# EAGLE design grayhill-knob-board (EAGLE 7.7.0)
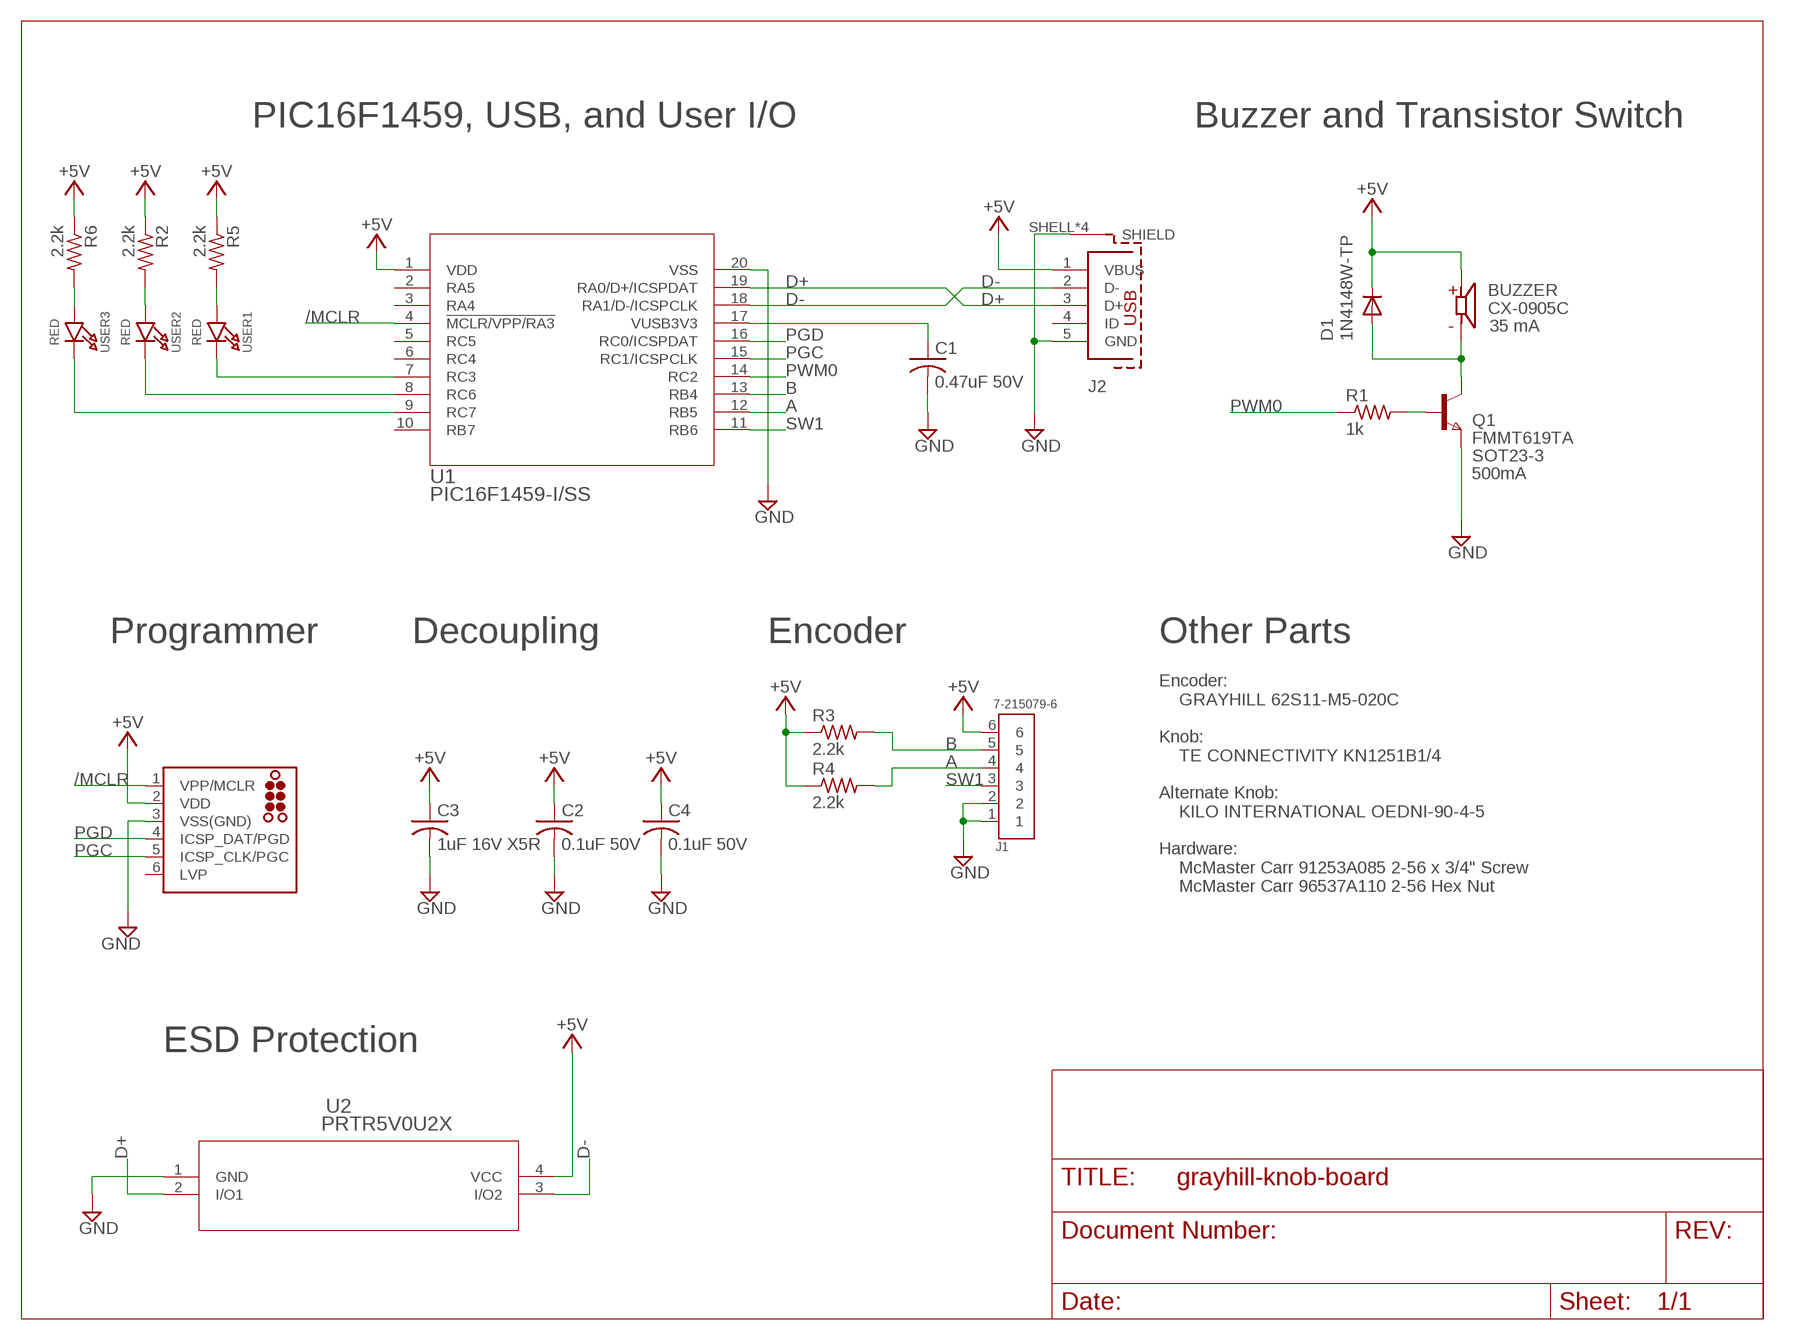
[diagram p0: schematic, sheet 1]

## Parts
BUZZER  CX-0905C  [CUI_CX-0905C]
C1  0.47uF 50V  C-USC1206K  [C1206K]
C2  0.1uF 50V  C-USC1206K  [C1206K]
C3  1uF 16V X5R  C-USC1210  [C1210]
C4  0.1uF 50V  C-USC1206K  [C1206K]
D1  1N4148W-TP  DIODE-SOD123  [SOD123]
J1  7-215079-6  [TE_7-215079-6]
J2  629105136821  [629105136821]
J3  TC2030-MCP-NL  [TC2030-MCP-NL]
Q1  FMMT619TA  NPNSOT23  [SOT-23]
R1  1k  R-US_R0805  [R0805]
R2  2.2k  R-US_R0805  [R0805]
R3  2.2k  R-US_R0805  [R0805]
R4  2.2k  R-US_R0805  [R0805]
R5  2.2k  R-US_R0805  [R0805]
R6  2.2k  R-US_R0805  [R0805]
U1  PIC16F1459-I/SS  [SSOP20_MC]
U2  PRTR5V0U2X  [SOT143B]
USER1  RED  LED0805_NOOUTLINE  [CHIPLED_0805_NOOUTLINE]
USER2  RED  LED0805_NOOUTLINE  [CHIPLED_0805_NOOUTLINE]
USER3  RED  LED0805_NOOUTLINE  [CHIPLED_0805_NOOUTLINE]

## Nets
+5V: BUZZER.P C2.1 C3.1 C4.1 D1.C J1.6 J2.1(VBUS) J3.2(VDD) R2.1 R3.1 R4.1 R5.1 R6.1 U1.1(VDD) U2.4(VCC)
/MCLR: J3.1(VPP/MCLR) U1.4(!MCLR/VPP/RA3)
A: J1.4 R4.2 U1.12(RB5)
B: J1.5 R3.2 U1.13(RB4)
D+: J2.3(D+) U1.19(RA0/D+/ICSPDAT) U2.2(I/O1)
D-: J2.2(D-) U1.18(RA1/D-/ICSPCLK) U2.3(I/O2)
GND: C1.2 C2.2 C3.2 C4.2 J1.1 J1.2 J2.5(GND) J2.SHELL1(SHIELD) J2.SHELL2(SHIELD) J2.SHELL3(SHIELD) J2.SHELL(SHIELD) J3.3(VSS(GND)) Q1.2(E) U1.20(VSS) U2.1(GND)
N$1: R6.2 USER3.A
N$2: R2.2 USER2.A
N$5: R5.2 USER1.A
N$16: Q1.3(B) R1.2
OUT0: BUZZER.N D1.A Q1.1(C)
PGC: J3.5(ICSP_CLK/PGC) U1.15(RC1/ICSPCLK)
PGD: J3.4(ICSP_DAT/PGD) U1.16(RC0/ICSPDAT)
PWM0: R1.1 U1.14(RC2)
SW1: J1.3 U1.11(RB6)
USER1: U1.7(RC3) USER1.C
USER2: U1.8(RC6) USER2.C
USER3: U1.9(RC7) USER3.C
VUSB: C1.1 U1.17(VUSB3V3)
Unconnected: J2.4(ID) J3.6(LVP) U1.2(RA5) U1.3(RA4) U1.5(RC5) U1.6(RC4) U1.10(RB7)

## Notes on the sheet
- PIC16F1459, USB, and User I/O | Buzzer and Transistor Switch
- 35 mA
- SOT23-3
- 500mA
- Programmer | Decoupling | Encoder | Other Parts
- Encoder:
      GRAYHILL 62S11-M5-020C
  
  Knob:
      TE CONNECTIVITY KN1251B1/4
  
  Alternate Knob:
      KILO INTERNATIONAL OEDNI-90-4-5
  
  Hardware:
      McMaster Carr 91253A085 2-56 x 3/4" Screw
      McMaster Carr 96537A110 2-56 Hex Nut
- ESD Protection

## Library data of the parts
BUZZER = CX-0905C:CX-0905C: 9.6 mm, 5 V, 80 dB, 2.7 kHz, Through Hole, Sealed, Driving Circuit, Magnetic Audio Indicator Buzzer; AVAILABILITY: Good; DESCRIPTION: 9.6 mm, 5 V, 80 dB, 2.7 kHz, Through Hole, Sealed, Driving Circuit, Magnetic Audio Indicator Buzzer; MF: CUI; MP: CX-0905C; PACKAGE: CUI; PRICE: 1.32 USD
C1 = rcl:C-US: CAPACITOR, American symbol; MFR: KEMET; MFR_PART_NO: C1206C474K5RACTU
C2 C4 = rcl:C-US: CAPACITOR, American symbol; MFR: KEMET; MFR_PART_NO: C1206S104M5RACTU
C3 = rcl:C-US: CAPACITOR, American symbol; MFR: KEMET; MFR_PART_NO: C1210C105K4PACTU
D1 = diode:DIODE-: DIODE
J1 = 7-215079-6:7-215079-6: Conn FFC Connector F 6 POS 1.27mm Solder ST Thru-Hole Automotive Box; COMMENT: 7-215079-6; DESCRIPTION: Conn FFC Connector F 6 POS 1.27mm Solder ST Thru-Hole Automotive Box/Carton; DIGI-KEY_PART_NUMBER: A30729CT-ND; DIGI-KEY_PURCHASE_URL: https://www.digikey.com/product-detail/en/te-connectivity-amp-connectors/7-215079-6/A30729CT-ND/740377?utm_source=snapeda&utm_medium=aggregator&utm_campaign=symbol; EU_ROHS_COMPLIANCE: Compliant; MF: TE Connectivity; MP: 7-215079-6; PACKAGE: None; TE_PURCHASE_URL: https://www.te.com/usa-en/product-7-215079-6.html?te_bu=Cor&te_type=disp&te_campaign=seda_glo_cor-seda-global-disp-prtnr-fy19-seda-model-bom-cta_sma-317_1&elqCampaignId=32493
J2 = InputOutputIO (rev18a):629105136821: WR-COM SMT Horizontal 5 Contacts Micro USB Type B,5 pins=>Code : Con_I-O_COM_MicroUSB_629105136821 <http://katalog.we-online.de/media/images/eican/Con_I-O_COM_MicroUSB_629105136821_pf2.jpg> Details see: http://katalog.we-online.de/en/em/COM_MICRO_SMT_TYPE_B_HORIZONTAL/629105136821?m Created 2014-07-09, Karrer Zheng 2014 (C) Würth Elektronik
J3 = tag-connect:TC2030: TAG-CONNECT ICSP Connector Manufacturer: Tag-Connect <http://www.tag-connect.com> Cable for easy In-Circuit Serial Programming. Designed for Microchip ICD2, suitable for many others. Two variants - one "with legs" (for hands-free fit on PCB) and another "without legs" for quick programming. PAD Description 1 MCLR/Vpp 2 Vdd 3 GND 4 PGD (ISPDAT) 5 PGC (ISPCLK) 6 nc (used for LVP) ©2009 ROFA.cz - modified and updated by Robert Darlington ‹rdarlington@gmail.com›
Q1 = zetex:NPNSOT23: NPN TRANSISTOR; MPN: DSS20201L-7; OC_FARNELL: 1710688; OC_NEWARK: 25R4555
R1-R6 = rcl:R-US_: RESISTOR, American symbol
U1 = pic16f1459-i-ss:PIC16F1459-I/SS; MANUFACTURER_PART_NUMBER: PIC16F1459ISS; VENDOR: Microchip
U2 = Nexperia_PRTR5V0U2X,215:PRTR5V0U2X; MANUFACTURER_PART_NUMBER: PRTR5V0U2X; VENDOR: NXP
USER1-USER3 = microbuilder:LED: LED 0603 - 0603 Surface Mount Package 2mA: Green LED - Low Power (3.9mcd, 2ma, 1.7Vf) - Digikey: 475-2709-2-ND Orange LED - Low Power (9.8mcd, 2ma, 1.8Vf) - Digikey: 475-1194-2-ND Red LED - Low Power (5mcd, 2ma, 1.8Vf) - Digikey: 475-1195-2-ND Yellow LED - Low Power (7mcd, 2ma, 1.8Vf) - Digikey: 475-1196-2-ND 5mA: Blue LED - Low Power (17mcd, 5ma, 2.9Vf) - Digikey: LNJ937W8CRACT-ND 0805 - 0805 Surface Mount Package 2mA: Red LED (8.8mcd, 2mA, 1.8Vf, Clear) - Low Power [Digikey: 475-2510-1-ND] Green LED (5mcd, 2mA, 1.8Vf, Clear) - Low Power [Digikey: 475-2730-1-ND] Yellow LED (11.3mcd, 2mA, 1.8Vf, Clear) - Low Power [Digikey: 475-2555-1-ND] 20mA: Red LED (104mcd, 20mA, Diffused) - LS R976 [Digikey: 475-1278-6-ND] Red LED (12mcd, 20mA, 2.0Vf, Clear) - APT2012EC [Digikey: 754-1128-1-ND] Green LED (15mcd, 20mA, 2.2Vf, Clear) - APT2012GC [Digikey: 754-1131-1-ND] Orange LED (160mcd, 20mA, 2.1Vf, Clear) - APT2012SECK [Digikey: 754-1130-1-ND] 1206 - 1206 Surface Mount Package Green LED (26mcd, 20mA, Diffused) - LG N971 [Digikey: 475-1407-6-ND] Red LED (15mcd, 20mA, Diffused) - LH N974 [Digikey: 475-1416-6-ND] Cree - Cree High-Power Surface Mount LEDs XPEBWT-L1-0000-00D50 - White 111lm 350mA 2.9Vf 6200K 110° XTEAWT-00-0000-00000LEE3 - White 114lm 350mA 2.85Vf 5000K 115° Everlight - Everlight 45-21 Series Surface Mount LEDs 45-21/QK2C-B2832AC2CB2/2T - Warm White 2000mcd 20mA 3.25Vf 3050K 120° 45-21/LK2C-B38452C4CB2/2T - Nuetral White 2000mcd 20mA 3.25Vf 4150K 120° 45-21/LK2C-B50634C6CB2/2T - Cold White 2200mcd 20mA 3.25Vf 5650K 120° PLCC2 Reverse Mount LS T77K-J1L2-1-0-2-R18-Z - Red 11.25mcd 2mA 1.8Vf 630nm 120° LO T77K-L1M2-24-Z - Orange 19.6mcd 2mA 1.8Vf 606nm 120° LY T77K-K2M1-26-Z - Yellow 15.7mcd 2mA 1.8Vf 587nm 120°

## Board
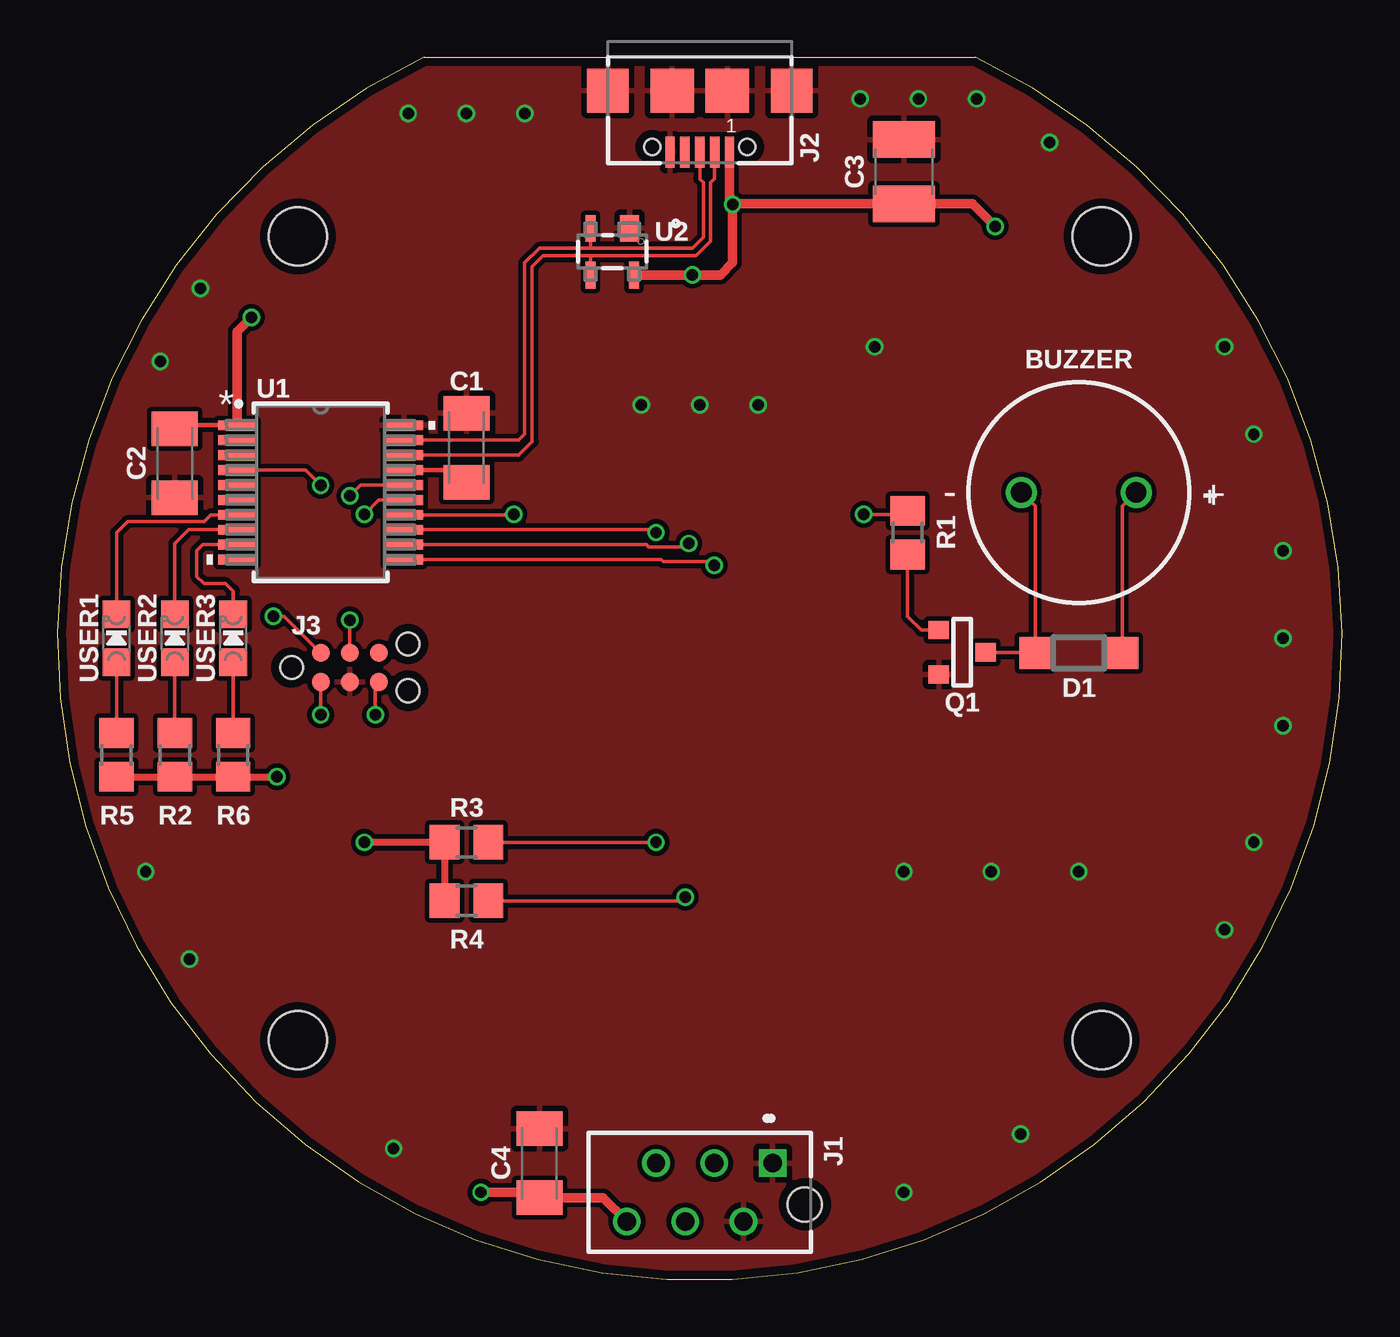
[diagram p1: board, top side]
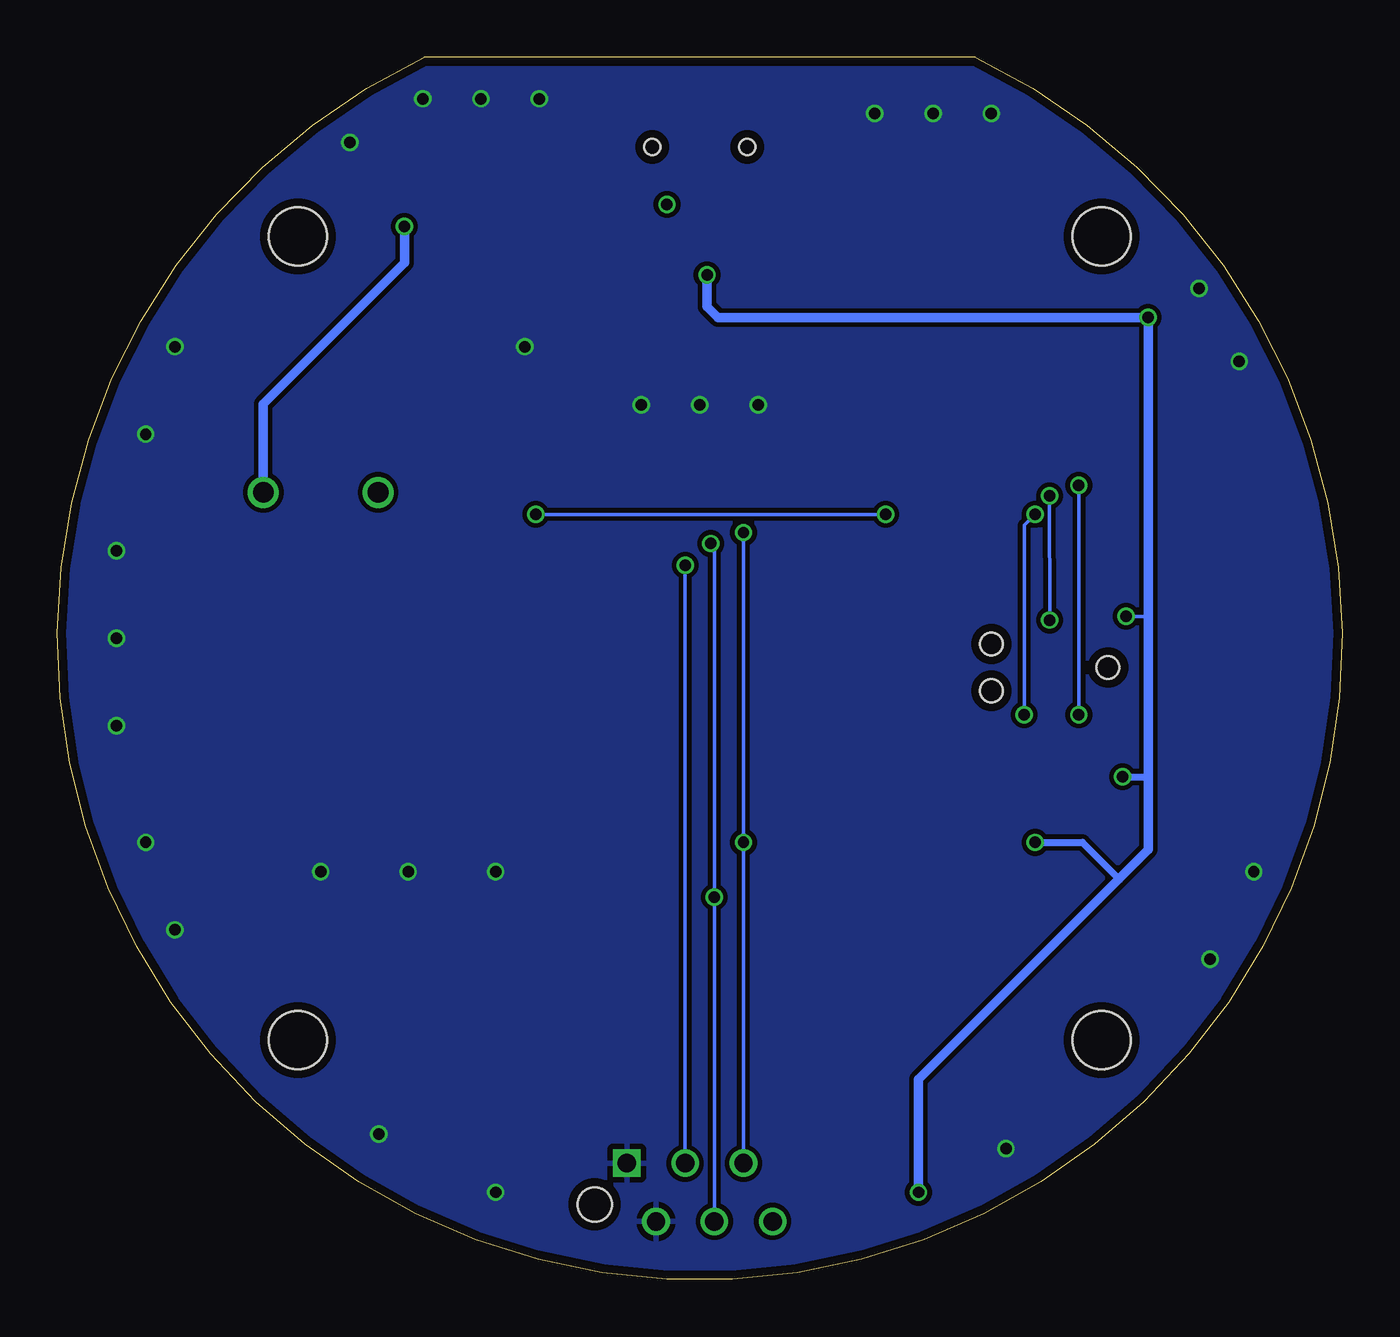
[diagram p2: board, bottom side, seen from below]

Size 55.95 x 53.21 mm. Coordinates in mm from the lower left corner, seen from the top.
Outline: 15.98,53.21 39.98,53.21 arc-309 15.98,53.21
Copper layers (1*16): Top 0.035559375mm / dielectric 1.6mm / Bottom 0.035559375mm
Design rules "oshpark-2layer-2018": minimum track width 6mil, minimum drill 10mil, track to track 6mil, track to pad 6mil, pad to pad 6mil, via to via 6mil, smd to smd 6mil, copper to edge 15mil, drill to drill 6mil, minimum pad ring 5mil, minimum via ring 5mil, stop-mask expansion 2.5mil, vias tented up to drill 0mil, thermal gap 10mil
Holes 2.54 mm at 10.47,10.41 45.48,10.41 10.47,45.41 45.48,45.41
tKeepout: area 42.7,7.6 to 48.2,13.2; area 7.7,42.6 to 13.2,48.2; area 7.7,7.6 to 13.2,13.2; area 42.7,42.6 to 48.2,48.2; area 21.6,7.6 to 34.3,34.3
bKeepout: 20 lines

### Footprints (pad centres in the part's own frame; a part is rotated, then mirrored left to right if it is on the bottom)
CUI_CX-0905C = drill 0.9: N 2.5,0; P -2.5,0
C1206K = smd 1.5 x 2: 1 -1.5,0; 2 1.5,0
C1210 = smd 1.6 x 2.7: 1 -1.4,0; 2 1.4,0
SOD123 = smd 1.4 x 1.4: A 1.9,0; C -1.9,0
TE_7-215079-6 = drill 0.8 square: 1 3.175,1.27 | drill 0.8: 2 1.905,-1.27; 3 0.635,1.27; 4 -0.635,-1.27; 5 -1.905,1.27; 6 -3.175,-1.27 | hole 1.5: 4.575,-0.53
629105136821 = smd 0.4 x 1.35: 1 -1.3,2.675; 2 -0.65,2.675; 3 0,2.675; 4 0.65,2.675; 5 1.3,2.675 | smd 1.8 x 1.9: SHELL -4,0; SHELL3 4,0 | smd 1.9 x 1.9: SHELL1 -1.2,0; SHELL2 1.2,0 | hole 0.7: -2.075,2.45; 2.075,2.45
TC2030-MCP-NL = smd 0.787 x 0.787: 1 1.27,-0.635; 2 1.27,0.635; 3 2.54,-0.635; 4 2.54,0.635; 5 3.81,-0.635; 6 3.81,0.635 | hole 0.991: 0,0; 5.08,-1.016; 5.08,1.016
SOT-23 = smd 0.787 x 0.889: 1 0.025,-1.016; 2 -0.94,1.016; 3 0.991,1.016
R0805 = smd 1.3 x 1.5: 1 -0.95,0; 2 0.95,0
SSOP20_MC = smd 1.651 x 0.432: 1 -3.632,2.925; 2 -3.632,2.275; 3 -3.632,1.625; 4 -3.632,0.975; 5 -3.632,0.325; 6 -3.632,-0.325; 7 -3.632,-0.975; 8 -3.632,-1.625; 9 -3.632,-2.275; 10 -3.632,-2.925; 11 3.632,-2.925; 12 3.632,-2.275; 13 3.632,-1.625; 14 3.632,-0.975; 15 3.632,-0.325; 16 3.632,0.325; 17 3.632,0.975; 18 3.632,1.625; 19 3.632,2.275; 20 3.632,2.925
SOT143B = smd 0.838 x 1.168: 1 -0.747,-1.016 | smd 0.432 x 1.168: 2 0.95,-1.016; 3 0.95,1.016; 4 -0.95,1.016
CHIPLED_0805_NOOUTLINE = smd 1.2 x 1.2: A 0,-1.05; C 0,1.05

### Placement (x,y rotation side)
BUZZER  44.49,34.26 180 top
C1  17.82,36.21 90 top
C2  5.12,35.53 270 top
C3  36.87,48.23 90 top
C4  20.99,5.05 90 top
D1  44.49,27.28 180 top
J1  27.98,3.78 0 top
J2  27.98,51.76 180 top
J3  10.2,26.64 0 top
Q1  39.41,27.28 90 top
R1  37.02,32.52 270 top
R2  5.12,22.83 90 top
R3  17.82,19.02 0 top
R4  17.82,16.48 0 top
R5  2.58,22.83 90 top
R6  7.66,22.83 90 top
U1  11.47,34.26 0 top
U2  24.17,44.75 180 top
USER1  2.58,27.91 0 top
USER2  5.12,27.91 0 top
USER3  7.66,27.91 0 top

### Tracks (layer width: path | path; a pad name or v marks a point on that pad's centre or on a via)
+5V  (via drill 0.5)
  Top 0.152: 5.27,37.19 C2.1 | D1.C 46.39,33.66 BUZZER.P | J3.2 9.88,28.87 v9.4,28.87 | v9.56,21.88 | C4.1 20.13,3.78
  Top 0.203: U1.1 5.27,37.19
  Top 0.305: R5.1 R2.1 R6.1 v9.56,21.88 | R4.1 R3.1 v13.37,19.02
  Top 0.406: J2.1 29.28,46.93 v29.4,46.8 | v29.4,46.8 29.43,46.83 C3.1 39.85,46.83 v40.83,45.85 | U2.4 v27.66,43.73 28.87,43.73 29.4,44.26 v29.4,46.8 | U1.1 7.83,41.27 v8.45,41.88 | C4.1 23.76,3.55 J1.6 | 20.13,3.78 v18.45,3.78
  Bottom 0.152: v9.4,28.87 8.45,28.87 | 8.61,21.88 8.45,21.72
  Bottom 0.305: v9.56,21.88 8.61,21.88 | v13.37,19.02 11.31,19.02 9.72,17.44
  Bottom 0.406: v40.83,45.85 40.83,44.26 46.99,38.11 BUZZER.P | v27.66,43.73 27.66,42.36 27.18,41.88 v8.45,41.88 8.45,28.87 8.45,21.72 8.45,18.71 9.72,17.44 18.45,8.7 v18.45,3.78
/MCLR  (via drill 0.5)
  Top 0.152: U1.4 10.81,35.24 v11.47,34.58 | v11.47,24.58 J3.1
  Bottom 0.152: v11.47,34.58 v11.47,24.58
A  (via drill 0.5)
  Top 0.152: U1.12 25.65,31.99 25.75,31.88 27.34,31.88 v27.5,32.04 | R4.2 27.18,16.48 v27.34,16.64
  Bottom 0.152: J1.4 v27.34,16.64 27.34,31.72 v27.5,32.04
B  (via drill 0.5)
  Top 0.152: U1.13 25.95,32.64 v26.07,32.52 | R3.2 v26.07,19.02
  Bottom 0.152: J1.5 v26.07,19.02 v26.07,32.52
D+
  Top 0.152: U1.19 20.09,36.54 20.36,36.8 20.36,44.26 20.99,44.9 23.22,44.9 | J2.3 27.98,47.92 28.13,47.76 28.13,45.38 27.66,44.9 23.22,44.9 | U2.2 23.22,44.9
D-
  Top 0.152: U1.18 20.08,35.89 20.67,36.49 20.67,44.11 21.15,44.58 23.22,44.58 | J2.2 28.63,47.93 28.45,47.76 28.45,45.22 27.82,44.58 23.22,44.58 | U2.3 23.22,44.58
GND  (via drill 0.5)
  other vias: 15.28,50.77 6.23,43.15 17.82,50.77 3.85,17.75 20.36,50.77 34.96,51.41 37.5,51.41 40.04,51.41 14.64,5.69 36.87,3.78 43.22,49.5 50.84,40.61 52.11,36.8 53.38,31.72 53.38,27.91 53.38,24.1 52.11,19.02 50.84,15.21 41.95,6.32 5.75,13.94 4.48,39.98 25.44,38.07 27.98,38.07 30.52,38.07 36.87,17.75 40.68,17.75 44.49,17.75 35.6,40.61
  pour Bottom (isolate 0.203): 15.98,53.21 arc309 39.98,53.21
  pour Top (isolate 0.203): 15.98,53.21 arc309 39.98,53.21
N$1
  Top 0.152: USER3.A R6.2
N$2
  Top 0.152: R2.2 USER2.A
N$5
  Top 0.152: USER1.A R5.2
N$16
  Top 0.152: R1.2 37.02,28.87 37.62,28.27 Q1.3
OUT0
  Top 0.152: Q1.1 42.56,27.3 D1.A 42.59,33.66 BUZZER.N
PGC  (via drill 0.5)
  Top 0.152: v13.85,24.58 13.85,25.85 J3.5 | U1.15 14,33.94 v13.37,33.31
  Bottom 0.152: v13.85,24.58 13.85,32.83 v13.37,33.31
PGD  (via drill 0.5)
  Top 0.152: J3.4 v12.74,28.71 | U1.16 13.21,34.58 v12.74,34.11
  Bottom 0.152: v12.74,28.71 v12.74,34.11
PWM0  (via drill 0.5)
  Top 0.152: U1.14 19.86,33.29 v19.88,33.31 | v35.12,33.31 36.55,33.31 R1.1
  Bottom 0.152: v19.88,33.31 v35.12,33.31
SW1  (via drill 0.5)
  Top 0.152: U1.11 26.3,31.34 26.39,31.25 28.45,31.25 v28.61,31.09
  Bottom 0.152: v28.61,31.09 J1.3
USER1
  Top 0.152: U1.7 6.68,33.29 6.39,32.99 3.05,32.99 2.58,32.52 USER1.C
USER2
  Top 0.152: U1.8 5.71,32.64 5.12,32.04 USER2.C
USER3
  Top 0.152: USER3.C 7.66,29.98 7.34,30.29 6.39,30.29 6.07,30.61 6.07,31.72 6.33,31.99 U1.9
VUSB
  Top 0.203: U1.17 17.29,35.24 C1.1

### Text on the board
_tsilk: J2 | C3 | U2 | BUZZER | C1 | U1 | C2 | - | + | R1 | USER1 | USER2 | USER3 | J3 | D1 | Q1 | R5 | R2 | R6 | R3 | R4 | J1 | C4